# Altium schematic sheet led-group-thin.SchDoc
size A
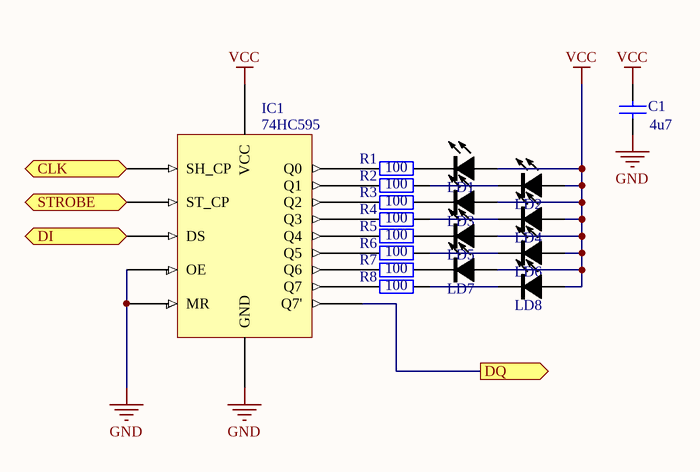
[diagram p0: led-group-thin.SchDoc]

## Parts
C1  value 4u7  [6-0805_M]  (hidden comment: Cap)
IC1  74HC595  [TSSOP16]
LD1  UV-LED  [0805-LED]  (value not drawn)
LD2  UV-LED  [0805-LED]  (value not drawn)
LD3  UV-LED  [0805-LED]  (value not drawn)
LD4  UV-LED  [0805-LED]  (value not drawn)
LD5  UV-LED  [0805-LED]  (value not drawn)
LD6  UV-LED  [0805-LED]  (value not drawn)
LD7  UV-LED  [0805-LED]  (value not drawn)
LD8  UV-LED  [0805-LED]  (value not drawn)
R1  value 100  [6-0805_N]
R2  value 100  [6-0805_N]
R3  value 100  [6-0805_N]
R4  value 100  [6-0805_N]
R5  value 100  [6-0805_N]
R6  value 100  [6-0805_N]
R7  value 100  [6-0805_N]
R8  value 100  [6-0805_N]

## Ports
CLK (in), DI (in), DQ (out), STROBE (in)

## Nets
GND: C1.1 IC1.8(GND) IC1.10(MR) IC1.13(OE)
VCC: C1.2 IC1.16(VCC) LD1.A LD2.A LD3.A LD4.A LD5.A LD6.A LD7.A LD8.A
CLK: IC1.11(SH_CP) ; port CLK
DI: IC1.14(DS) ; port DI
DQ: IC1.9(Q7') ; port DQ
STROBE: IC1.12(ST_CP) ; port STROBE
NetIC1_1: IC1.1(Q1) R2.1
NetIC1_2: IC1.2(Q2) R3.1
NetIC1_3: IC1.3(Q3) R4.1
NetIC1_4: IC1.4(Q4) R5.1
NetIC1_5: IC1.5(Q5) R6.1
NetIC1_6: IC1.6(Q6) R7.1
NetIC1_7: IC1.7(Q7) R8.1
NetIC1_15: IC1.15(Q0) R1.1
NetLD1_K: LD1.K R1.2
NetLD2_K: LD2.K R2.2
NetLD3_K: LD3.K R3.2
NetLD4_K: LD4.K R4.2
NetLD5_K: LD5.K R5.2
NetLD6_K: LD6.K R6.2
NetLD7_K: LD7.K R7.2
NetLD8_K: LD8.K R8.2

## Library data of the parts
C1 = Cap: Capacitor
IC1 = Component_1: 74HC595 8-bit latched SIPO shift register
R1-R8 = Res2: Resistor